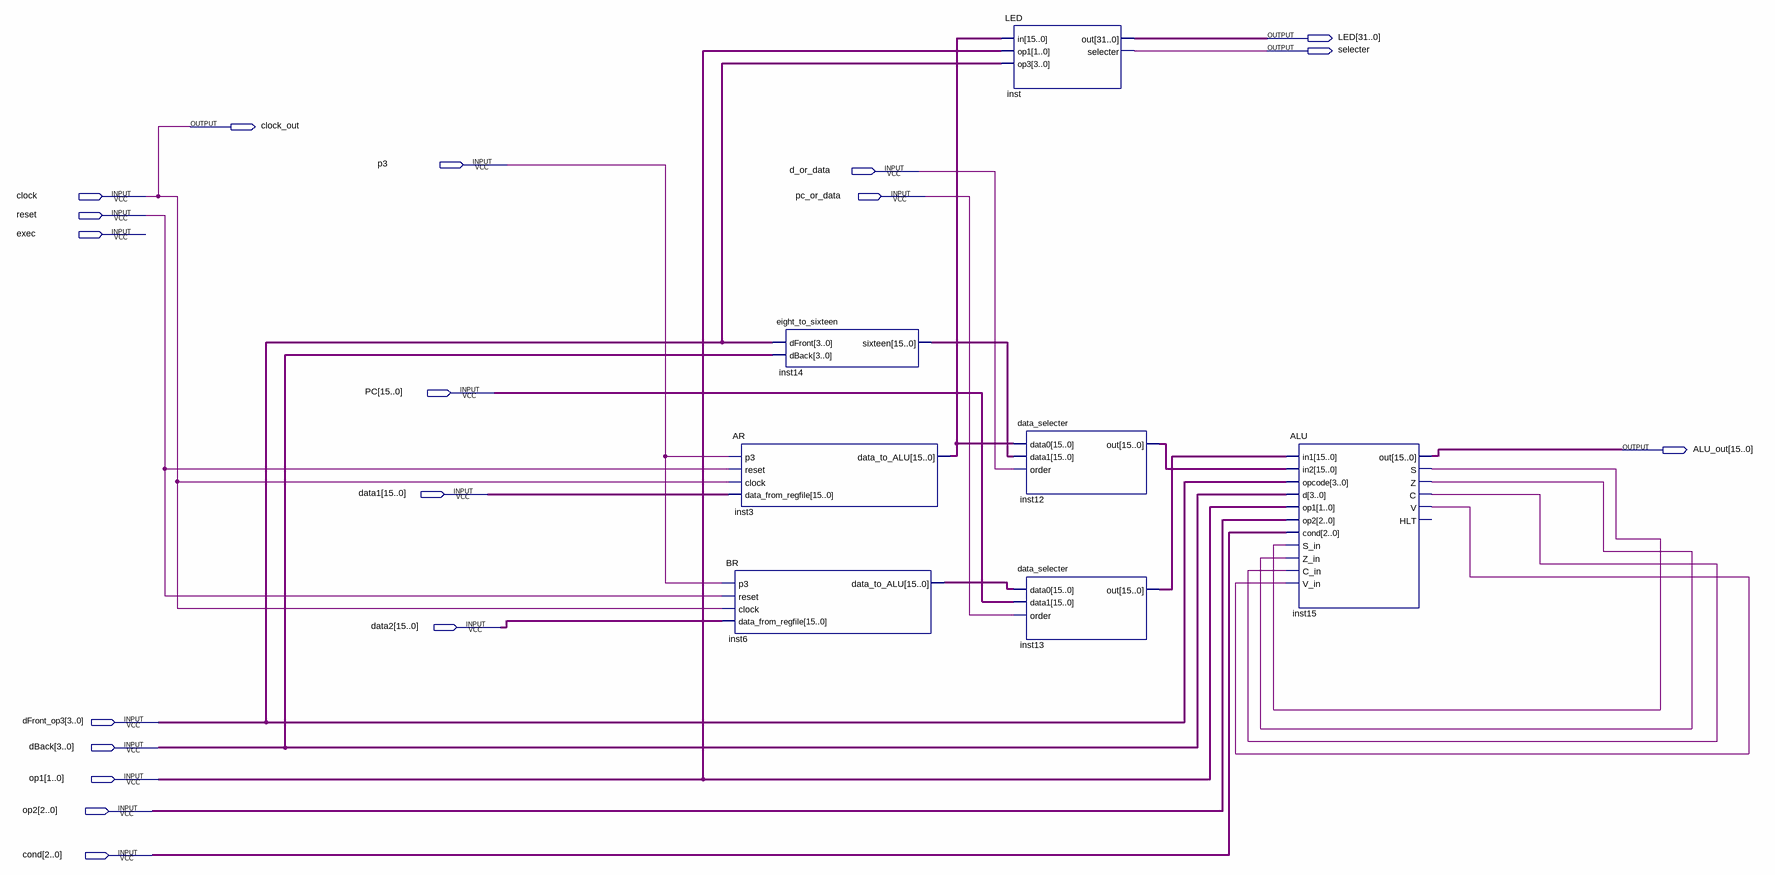
[diagram p0: schematic sheet]
// Quartus schematic processor_p3.bdf as structural Verilog: 7 symbols, 18 pins
module processor_p3 (
  input  p3,
  input  d_or_data,
  input  clock,
  input  pc_or_data,
  input  reset,
  input  exec,
  input  [15:0] PC,
  input  [15:0] data1,
  input  [15:0] data2,
  input  [3:0] dFront_op3,
  input  [3:0] dBack,
  input  [1:0] op1,
  input  [2:0] op2,
  input  [2:0] cond,
  output [31:0] LED,
  output selecter,
  output clock_out,
  output [15:0] ALU_out
);

  wire inst15_c, inst15_s, inst15_v, inst15_z;
  wire [15:0] inst3_data_to_alu, inst6_data_to_alu, inst12_out, inst13_out, inst14_sixteen;

  AR inst3 (.p3(p3), .reset(reset), .clock(clock), .data_from_regfile(data1), .data_to_ALU(inst3_data_to_alu));
  BR inst6 (.p3(p3), .reset(reset), .clock(clock), .data_from_regfile(data2), .data_to_ALU(inst6_data_to_alu));
  eight_to_sixteen inst14 (.dFront(dFront_op3), .dBack(dBack), .sixteen(inst14_sixteen));
  LED inst (.in(inst3_data_to_alu), .op1(op1), .op3(dFront_op3), .out(LED), .selecter(selecter));
  data_selecter inst12 (.data0(inst3_data_to_alu), .data1(inst14_sixteen), .order(d_or_data), .out(inst12_out));
  data_selecter inst13 (.data0(inst6_data_to_alu), .data1(PC), .order(pc_or_data), .out(inst13_out));
  ALU inst15 (
    .in1(inst13_out), .in2(inst12_out), .opcode(dFront_op3), .d(dBack), .op1(op1), .op2(op2), .cond(cond),
    .S_in(inst15_s), .Z_in(inst15_z), .C_in(inst15_c), .V_in(inst15_v), .out(ALU_out), .S(inst15_s),
    .Z(inst15_z), .C(inst15_c), .V(inst15_v));  // open: HLT

  assign clock_out = clock;
endmodule
